# Altium schematic sheet Recepteur.SchDoc
size A4
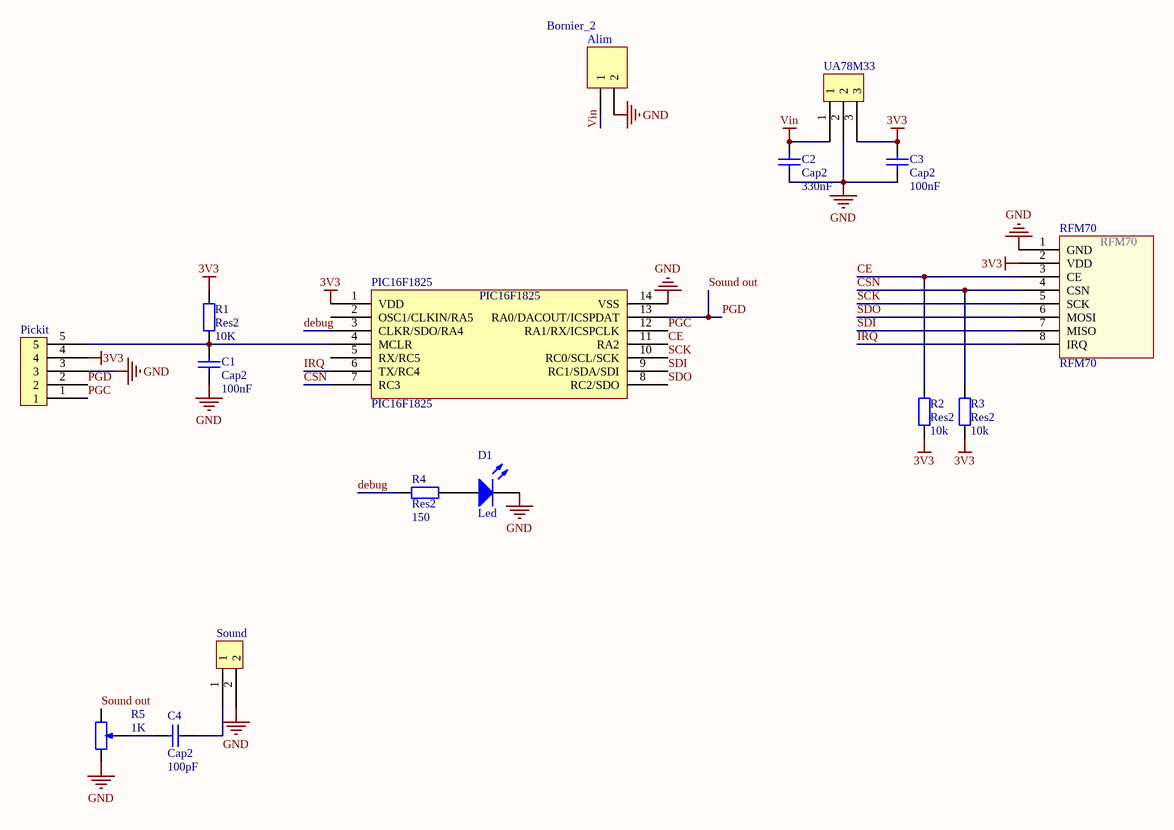
[diagram p0: Recepteur.SchDoc]

## Parts
Alim  Bornier_2  [Bornier_2]
C1  Cap2  value 100nF  [CAPA2]
C2  Cap2  value 330nF  [CAPA2]
C3  Cap2  value 100nF  [CAPA2]
C4  Cap2  value 100pF  [CAPA2]
D1  Led  [LED]
PIC16F1825  PIC16F1825  [PIC16F1825]
Pickit  CONKK5  [CONKK5]  (value not drawn)
R1  Res2  value 10K  [res5_1/4W]
R2  Res2  value 10k  [res5_1/4W]
R3  Res2  value 10k  [res5_1/4W]
R4  Res2  value 150  [res5_1/4W]
R5  value 1K  [AJUSTABLE]  (hidden comment: RPot1)
RFM70  RFM70  [RFM70]
Sound  CONKK2  [CONKK2]  (value not drawn)
UA78M33  CONKK3  [CONKK3]  (value not drawn)

## Nets
3V3: C3.2 PIC16F1825.1(VDD) Pickit.4 R1.2 R2.1 R3.1 RFM70.2(VDD) UA78M33.3
GND: Alim.2 C1.1 C2.1 C3.1 D1.2(K) PIC16F1825.14(VSS) Pickit.3 R5.1 RFM70.1(GND) Sound.2 UA78M33.2
Vin: Alim.1 C2.2 UA78M33.1
CE: PIC16F1825.11(RA2) R2.2 RFM70.3(CE)
CSN: PIC16F1825.7(RC3) R3.2 RFM70.4(CSN)
debug: PIC16F1825.3(CLKR/SDO/RA4) R4.1
IRQ: PIC16F1825.6(TX/RC4) RFM70.8(IRQ)
PGC: PIC16F1825.12(RA1/RX/ICSPCLK) Pickit.1
PGD: PIC16F1825.13(RA0/DACOUT/ICSPDAT) Pickit.2 R5.2  [also labelled Sound out]
SCK: PIC16F1825.10(RC0/SCL/SCK) RFM70.5(SCK)
SDI: PIC16F1825.9(RC1/SDA/SDI) RFM70.7(MISO)
SDO: PIC16F1825.8(RC2/SDO) RFM70.6(MOSI)
NetC1_2: C1.2 PIC16F1825.4(MCLR) Pickit.5 R1.1
NetC4_1: C4.1 R5.3
NetC4_2: C4.2 Sound.1
NetD1_1: D1.1(A) R4.2

Not connected (* = marked no-connect by the designer): PIC16F1825 2(OSC1/CLKIN/RA5) 5(RX/RC5)

## Library data of the parts
Alim = Bornier_2: Header, 2-Pin; LatestRevisionDate: 17-Jul-2002; LatestRevisionNote: Re-released for DXP Platform.; Publisher: Altium Limited
C1-C4 = Cap2: Capacitor; Published: 8-Jun-2000; LatestRevisionDate: 17-Jul-2002; LatestRevisionNote: Re-released for DXP Platform.; PackageReference: RAD-0.3; Publisher: Altium Limited
R1-R4 = Res2: Resistor; Published: 8-Jun-2000; LatestRevisionDate: 17-Jul-2002; LatestRevisionNote: Re-released for DXP Platform.; PackageReference: AXIAL-0.4; Publisher: Altium Limited
R5 = RPot1: Potentiometer; Sim Note: Enter the Resistance value and the set point into parameter fields.; Set Position: 0.5; Published: 8-Jun-2000; LatestRevisionDate: 17-Jul-2002; LatestRevisionNote: Re-released for DXP Platform.; PackageReference: VR5; Publisher: Altium Limited
D1 = Led: Published: 8-Jun-2000; LatestRevisionDate: 17-Jul-2002; LatestRevisionNote: Re-released for DXP Platform.; DatasheetDocument: 1998; PackageDocument: Aug-1999; PackageReference: DO-41; Publisher: Altium Limited; Code_JEDEC: DO-204-AL; ComponentLink1Description: Manufacturer Link; ComponentLink1URL: http://www.fairchildsemi.com/; ComponentLink2Description: Datasheet; ComponentLink2URL: http://www.fairchildsemi.com/ds/1N%2F1N4001.pdf